# EAGLE schematic right_angle_AVR (EAGLE 5.10)
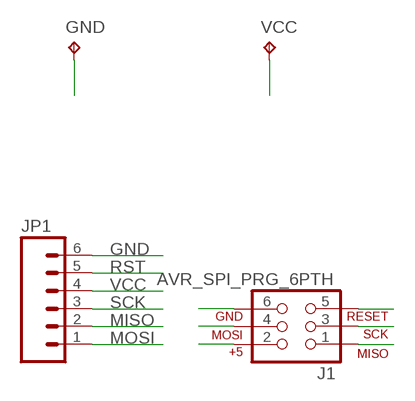
[diagram p0: schematic, sheet 1]

## Parts
GND  TPPAD1-13Y  [P1-13Y]
J1  AVR_SPI_PRG_6PTH  [2X3]
JP1  M06POGO_X6  [POGO_HORZ_X6]
VCC  TPPAD1-13Y  [P1-13Y]

## Nets
GND: GND.TP J1.6 JP1.6
MISO: J1.1 JP1.2
MOSI: J1.4 JP1.1
RST: J1.5 JP1.5
SCK: J1.3 JP1.3
VCC: J1.2 JP1.4 VCC.TP

## Library data of the parts
GND VCC = testpad:TP: Test pad
J1 = SparkFun:AVR_SPI_PRG_6: AVR ISP 6 Pin This is the reduced ISP connector for AVR programming. Common on Arduino. This footprint will take up less PCB space and can be used with a 10-pin to 6-pin adapter such as SKU: BOB-08508
JP1 = right_angle_AVR:M06